# Altium project Helianthus REV 2.1 .PrjPcb
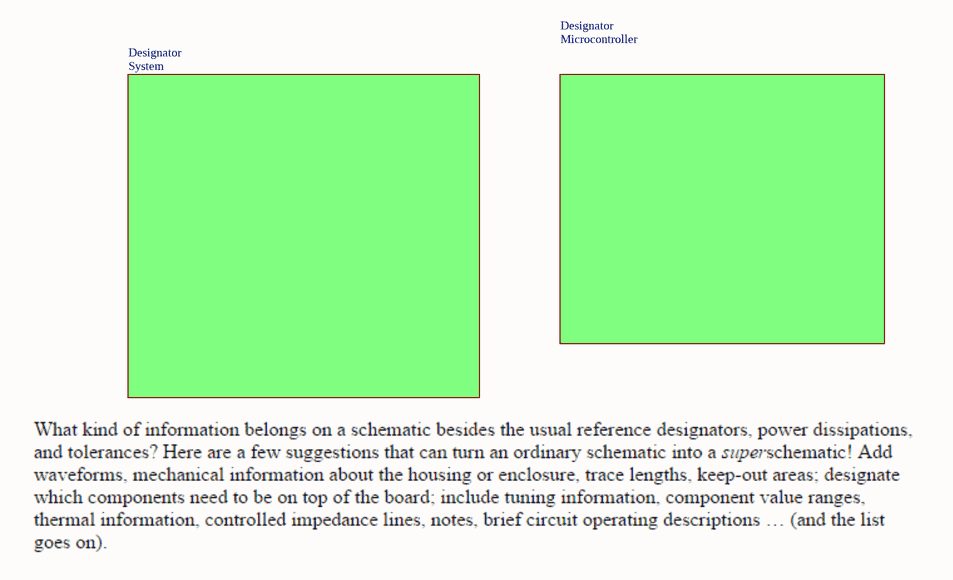
[diagram p0: Overview.SchDoc]
3 sheets, 68 parts. Net scope: global (net labels, ports and power ports of the same name join across sheets).
Board file: PCB_dense_experiment.PcbDoc
Sheets:
  Overview.SchDoc
    Designator = System.SchDoc
    Designator = Microcontroller.SchDoc

## Sheet Overview.SchDoc
size A

### Sub-sheets
Designator = System: no entries
Designator = Microcontroller: no entries

## Sheet System.SchDoc
size A
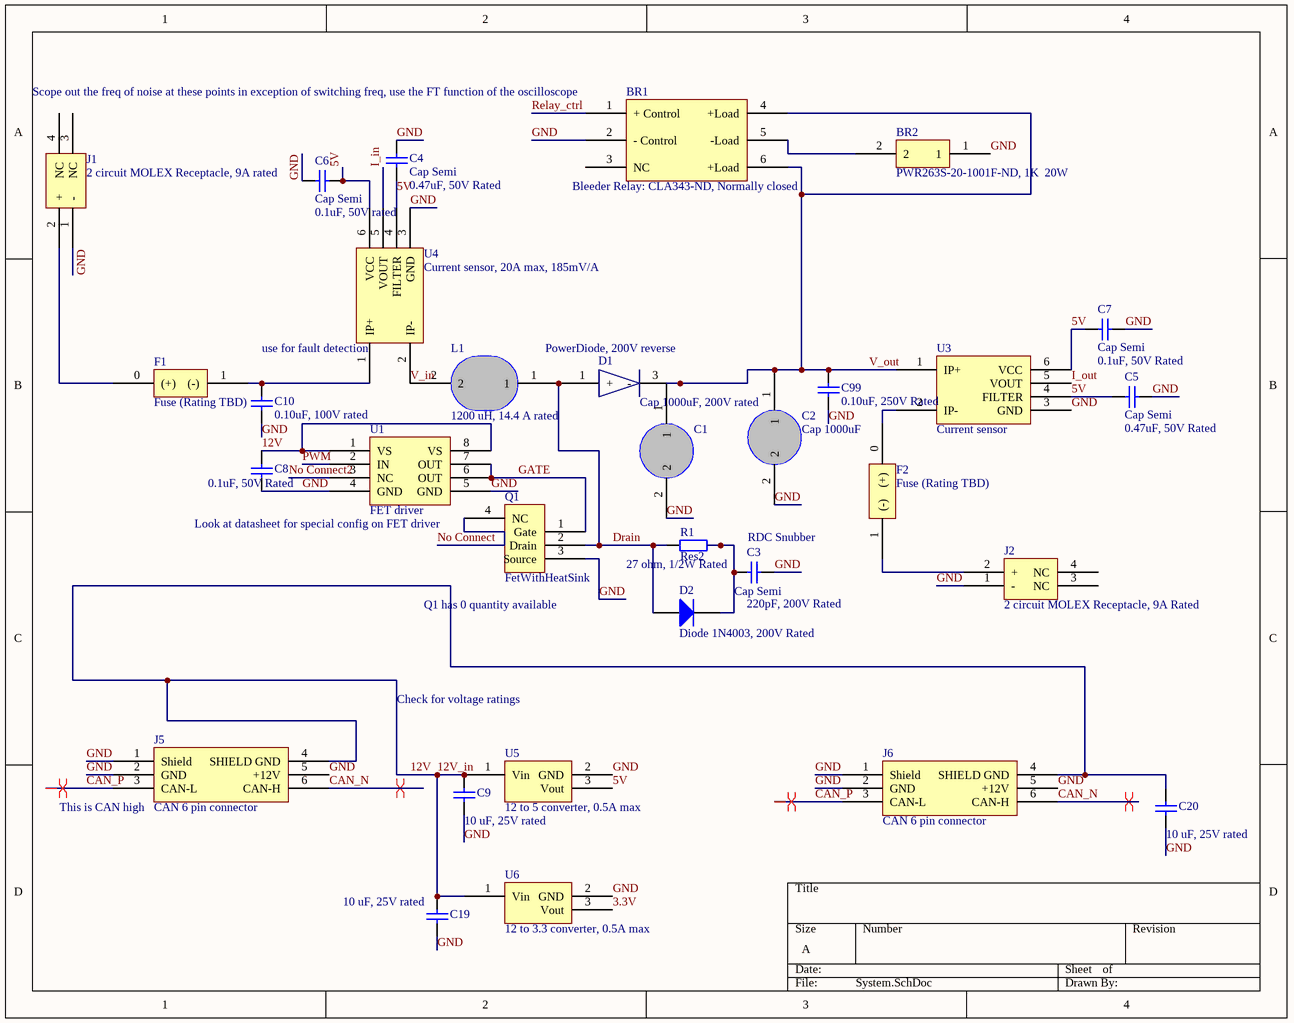
[diagram p1: System.SchDoc]

### Parts
BR1  Bleeder Relay: CLA343-ND, Normally closed  [Bleeder Relay: CLA343-ND]
BR2  PWR263S-20-1001F-ND, 1K  20W  [PWR263S-20-1001F-ND]
C1  Cap 1000uF, 200V rated  [LargeCap]
C2  Cap 1000uF  [LargeCap]
C3  Cap Semi  value 220pF, 200V Rated  [C1206]
C4  Cap Semi  value 0.47uF, 50V Rated  [C1206]
C5  Cap Semi  value 0.47uF, 50V Rated  [C1206]
C6  Cap Semi  value 0.1uF, 50V rated  [C1206]
C7  Cap Semi  value 0.1uF, 50V Rated  [C1206]
C8  value 0.1uF, 50V Rated  [C1206]  (hidden comment: Cap Semi)
C9  value 10 uF, 25V rated  [C1206]  (hidden comment: Cap Semi)
C10  value 0.10uF, 100V rated  [C1210]  (hidden comment: Cap Semi)
C19  value 10 uF, 25V rated  [C1206]  (hidden comment: Cap Semi)
C20  value 10 uF, 25V rated  [C1206]  (hidden comment: Cap Semi)
C99  value 0.10uF, 250V Rated  [C1210]  (hidden comment: Cap Semi)
D1  PowerDiode, 200V reverse  [PowerDiode]
D2  Diode 1N4003, 200V Rated  [Diode RDC]
F1  Fuse (Rating TBD)  [Fuseholder]
F2  Fuse (Rating TBD)  [Fuseholder]
J1  2 circuit MOLEX Receptacle, 9A rated  [2 circuit MOLEX Receptacle]
J2  2 circuit MOLEX Receptacle, 9A Rated  [2 circuit MOLEX Receptacle]
J5  CAN 6 pin connector  [CAN 6 pin connector]
J6  CAN 6 pin connector  [CAN 6 pin connector]
L1  1200 uH, 14.4 A rated  [Large Inductor]
Q1  FetWithHeatSink  [FetWithHeatSink]
R1  Res2  value 27 ohm, 1/2W Rated  [RES RDC]
U1  FET driver  [FET Driver]
U3  Current sensor  [Current sensor]
U4  Current sensor, 20A max, 185mV/A  [Current sensor]
U5  12 to 5 converter, 0.5A max  [12 to 5 converter]
U6  12 to 3.3 converter, 0.5A max  [12 to 5 converter]

### Nets
3.3V: U6.3(Vout)
5V: C4.1 C5.1 C6.1 C7.1 U3.4(FILTER) U3.6(VCC) U4.4(FILTER) U4.6(VCC) U5.3(Vout)
12V: C8.1 C9.2 C19.2 C20.2 J5.4(SHIELD_GND) J6.4(SHIELD_GND) U1.1(VS) U1.8(VS) U5.1(Vin) U6.1(Vin)  [also labelled 12V_in]
CAN_N: J5.6(CAN-H) J6.6(CAN-H)
CAN_P: J5.3(CAN-L) J6.3(CAN-L)
Drain: D1.1(+) D2.1(A) L1.1 Q1.2(Drain) R1.1
GATE: Q1.1(Gate) U1.6(OUT) U1.7(OUT)
GND: BR1.2(-_Control) BR2.1 C1.2 C2.2 C3.2 C4.2 C5.2 C6.2 C7.2 C8.2 C9.1 C10.2 C19.1 C20.1 C99.1 J1.1(-) J2.1(-) J5.1(Shield) J5.2(GND) J5.5(+12V) J6.1(Shield) J6.2(GND) J6.5(+12V) Q1.3(Source) U1.4(GND) U1.5(GND) U3.3(GND) U4.3(GND) U5.2(GND) U6.2(GND)
I_in: U4.5(VOUT)
I_out: U3.5(VOUT)
No Connect: Q1.4(NC)
No Connect2: U1.3(NC)
PWM: U1.2(IN)
Relay_ctrl: BR1.1(+_Control)
V_in: L1.2 U4.2(IP-)
V_out: BR1.4(+Load) BR1.6(+Load) C1.1 C2.1 C99.2 D1.3(-) U3.1(IP+)
NetBR1_5: BR1.5(-Load) BR2.2
NetC3_1: C3.1 D2.2(K) R1.2
NetC10_1: C10.1 F1.1((-)) U4.1(IP+)
NetF1_0: F1.0((+)) J1.2(+)
NetF2_0: F2.0((+)) U3.2(IP-)
NetF2_1: F2.1((-)) J2.2(+)

Not connected (* = marked no-connect by the designer): BR1 3(NC); J1 3(NC) 4(NC); J2 3(NC) 4(NC)

### Layout directives
differential pair: CAN_N, CAN_P

### Notes on the sheet
- (near BR1) Scope out the freq of noise at these points in exception of switching freq, use the FT function of the oscilloscope
- (near U4) use for fault detection
- (near Q1) Look at datasheet for special config on FET driver
- RDC Snubber
- (near Q1) Q1 has 0 quantity available
- Check for voltage ratings
- (near J5) This is CAN high

### Library data of the parts
BR1 = Bleeder Relay: CLA343-ND
BR2 = PWR263S-20-1001F-ND
C1 C2 = Cap 1200uF
C3-C10 C19 C20 C99 = Cap Semi: Capacitor (Semiconductor SIM Model); Published: 8-Jun-2000; LatestRevisionDate: 29-May-2009; LatestRevisionNote: IPC-7351 Footprint Added.; PackageReference: C1206; Publisher: Altium Limited; PackageDescription: Chip Capacitor
D1 = PowerDiode
D2 = Diode 1N4003: 1 Amp General Purpose Rectifier; Published: 8-Jun-2000; LatestRevisionDate: 17-Jul-2002; LatestRevisionNote: Re-released for DXP Platform.; DatasheetVersion: 1998; PackageVersion: Aug-1999; PackageReference: DO-41; Publisher: Altium Limited; PackageDescription: Diode, Axial; Body 5.2 x 2.7 mm (LxDia. max), Lead Dia. 0.86 mm (max); Code_JEDEC: DO-204-AL; ComponentLink1Description: Manufacturer Link; ComponentLink1URL: http://www.fairchildsemi.com/; ComponentLink2Description: Datasheet; ComponentLink2URL: http://www.fairchildsemi.com/ds/1N%2F1N4001.pdf
F1 F2 = Fuseholder
J1 J2 = 2 circuit MOLEX Receptacle
L1 = Large inductor: 120 uH
R1 = Res2: Resistor; Published: 8-Jun-2000; LatestRevisionDate: 17-Jul-2002; LatestRevisionNote: Re-released for DXP Platform.; PackageReference: AXIAL-0.4; Publisher: Altium Limited; PackageDescription: Axial Device, Thru-Hole; 2 Leads; 0.4 in Pin Spacing
U3 = Current sensor: This is the new current sensor 620-1262-1-ND
U4 = Current sensor: This is the new current sensor 620-1262-1-ND. Cap at filter pin determines the bandwidth of the device
U5 U6 = 12 to 5 converter

## Sheet Microcontroller.SchDoc
size A
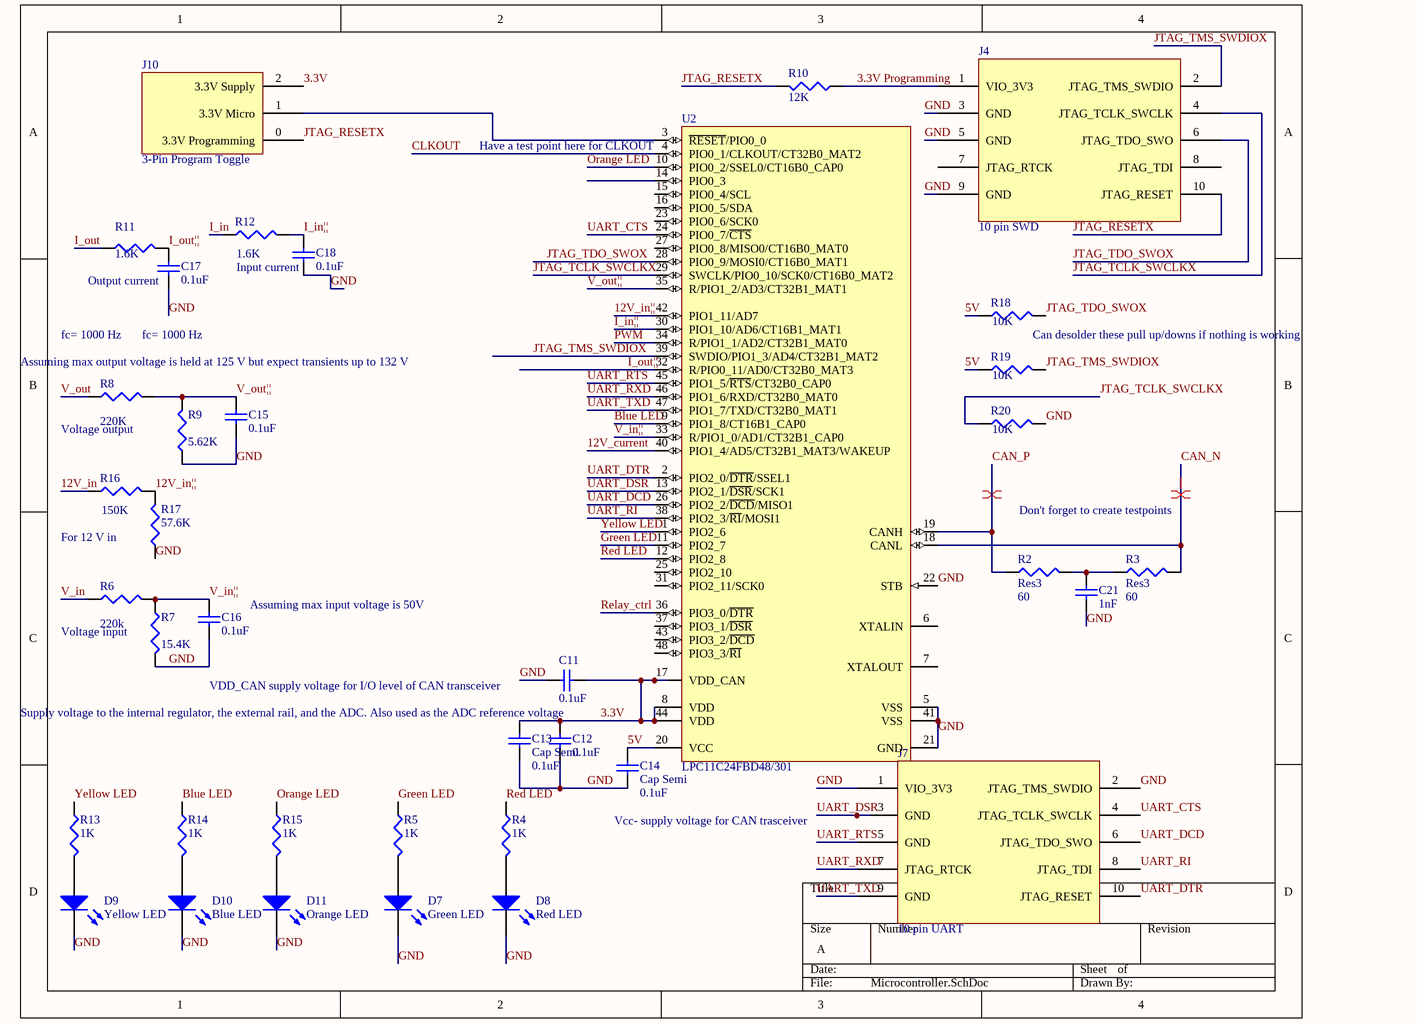
[diagram p2: Microcontroller.SchDoc]

### Parts
C11  value 0.1uF  [C1206]  (hidden comment: Cap Semi)
C12  value 0.1uF  [C1206]  (hidden comment: Cap Semi)
C13  Cap Semi  value 0.1uF  [C1206]
C14  Cap Semi  value 0.1uF  [C1206]
C15  value 0.1uF  [C1206]  (hidden comment: Cap Semi)
C16  value 0.1uF  [C1206]  (hidden comment: Cap Semi)
C17  value 0.1uF  [C1206]  (hidden comment: Cap Semi)
C18  value 0.1uF  [C1206]  (hidden comment: Cap Semi)
C21  value 1nF  [C1206]  (hidden comment: Cap Semi)
D7  Green LED  [C1206]
D8  Red LED  [C1206]
D9  Yellow LED  [C1206]
D10  Blue LED  [C1206]
D11  Orange LED  [C1206]
J4  10 pin SWD  [10 Pin JTAG/SWD]
J7  10 pin UART  [10 Pin JTAG/SWD]
J10  3-Pin Program Toggle  [3-Pin Program Toggle]
R2  Res3  value 60  [12Z-2010]
R3  Res3  value 60  [12Z-2010]
R4  value 1K  [C1206]  (hidden comment: Res3)
R5  value 1K  [C1206]  (hidden comment: Res3)
R6  value 220k  [C1206]  (hidden comment: Res3)
R7  value 15.4K  [C1206]  (hidden comment: Res3)
R8  value 220K  [C1206]  (hidden comment: Res3)
R9  value 5.62K  [C1206]  (hidden comment: Res3)
R10  value 12K  [C1206]  (hidden comment: Res3)
R11  value 1.6K  [C1206]  (hidden comment: Res3)
R12  value 1.6K  [C1206]  (hidden comment: Res3)
R13  value 1K  [C1206]  (hidden comment: Res3)
R14  value 1K  [C1206]  (hidden comment: Res3)
R15  value 1K  [C1206]  (hidden comment: Res3)
R16  value 150K  [C1206]  (hidden comment: Res3)
R17  value 57.6K  [C1206]  (hidden comment: Res3)
R18  value 10K  [C1206]  (hidden comment: Res3)
R19  value 10K  [C1206]  (hidden comment: Res3)
R20  value 10K  [C1206]  (hidden comment: Res3)
U2  LPC11C24FBD48/301  [SOT313-2_V]

### Nets
3.3V: C11.1 C12.2 C13.2 J10.2(3.3V_Supply) U2.8(VDD) U2.17(VDD_CAN) U2.44(VDD)
3.3V Programming: J4.1(VIO_3V3) R10.1
5V: C14.2 R18.1 R19.1 U2.20(VCC)
12V_current: U2.40(PIO1_4/AD5/CT32B1_MAT3/WAKEUP)
12V_in: R16.1  [project net 12V]
12V_in||: R16.2 R17.2 U2.42(PIO1_11/AD7)
Blue LED: R14.1 U2.9(PIO1_8/CT16B1_CAP0)
CAN_N: R3.2 U2.18(CANL)
CAN_P: R2.1 U2.19(CANH)
CLKOUT: U2.4(PIO0_1/CLKOUT/CT32B0_MAT2)
GND: C11.2 C12.1 C13.1 C14.1 C15.1 C16.2 C17.2 C18.2 C21.2 D7.2(K) D8.2(K) D9.2(K) D10.2(K) D11.2(K) J4.3(GND) J4.5(GND) J4.9(GND) J7.1(VIO_3V3) J7.2(JTAG_TMS_SWDIO) R7.2 R9.1 R17.1 R20.2 U2.5(VSS) U2.21(GND) U2.22(STB) U2.41(VSS)
Green LED: R5.1 U2.11(PIO2_7)
I_in: R12.1
I_in||: C18.1 R12.2 U2.30(PIO1_10/AD6/CT16B1_MAT1)
I_out: R11.1
I_out||: C17.1 R11.2 U2.32(R/PIO0_11/AD0/CT32B0_MAT3)
JTAG_RESETX: J4.10(JTAG_RESET) J10.0(3.3V_Programming) R10.2
JTAG_TCLK_SWCLKX: J4.4(JTAG_TCLK_SWCLK) R20.1 U2.29(SWCLK/PIO0_10/SCK0/CT16B0_MAT2)
JTAG_TDO_SWOX: J4.6(JTAG_TDO_SWO) R18.2 U2.28(PIO0_9/MOSI0/CT16B0_MAT1)
JTAG_TMS_SWDIOX: J4.2(JTAG_TMS_SWDIO) R19.2 U2.39(SWDIO/PIO1_3/AD4/CT32B1_MAT2)
Orange LED: R15.1 U2.10(PIO0_2/SSEL0/CT16B0_CAP0)
PWM: U2.34(R/PIO1_1/AD2/CT32B1_MAT0)
Red LED: R4.1 U2.12(PIO2_8)
Relay_ctrl: U2.36(PIO3_0/~{DTR})
UART_CTS: J7.4(JTAG_TCLK_SWCLK) U2.24(PIO0_7/~{CTS})
UART_DCD: J7.6(JTAG_TDO_SWO) U2.26(PIO2_2/~{DCD}/MISO1)
UART_DSR: J7.3(GND) U2.13(PIO2_1/~{DSR}/SCK1)
UART_DTR: J7.10(JTAG_RESET) U2.2(PIO2_0/~{DTR}/SSEL1)
UART_RI: J7.8(JTAG_TDI) U2.38(PIO2_3/~{RI}/MOSI1)
UART_RTS: J7.5(GND) U2.45(PIO1_5/~{RTS}/CT32B0_CAP0)
UART_RXD: J7.7(JTAG_RTCK) U2.46(PIO1_6/RXD/CT32B0_MAT0)
UART_TXD: J7.9(GND) U2.47(PIO1_7/TXD/CT32B0_MAT1)
V_in: R6.1
V_in||: C16.1 R6.2 R7.1 U2.33(R/PIO1_0/AD1/CT32B1_CAP0)
V_out: R8.1
V_out||: C15.2 R8.2 R9.2 U2.35(R/PIO1_2/AD3/CT32B1_MAT1)
Yellow LED: R13.1 U2.1(PIO2_6)
NetC21_1: C21.1 R2.2 R3.1
NetD7_1: D7.1(A) R5.2
NetD8_1: D8.1(A) R4.2
NetD9_1: D9.1(A) R13.2
NetD10_1: D10.1(A) R14.2
NetD11_1: D11.1(A) R15.2
NetJ10_1: J10.1(3.3V_Micro) U2.3(~{RESET}/PIO0_0)

Not connected (* = marked no-connect by the designer): J4 7(JTAG_RTCK) 8(JTAG_TDI); U2 6(XTALIN) 7(XTALOUT) 14(PIO0_3) 15(PIO0_4/SCL) 16(PIO0_5/SDA) 23(PIO0_6/SCK0) 25(PIO2_10) 27(PIO0_8/MISO0/CT16B0_MAT0) 31(PIO2_11/SCK0) 37(PIO3_1/~{DSR}) 43(PIO3_2/~{DCD}) 48(PIO3_3/~{RI})

### Layout directives
differential pair: CAN_N, CAN_P

### Notes on the sheet
- (near U2) Have a test point here for CLKOUT
- (near C17) Output current
- (near C18) Input current
- Assuming max output voltage is held at 125 V but expect transients up to 132 V
- fc= 1000 Hz
- (near R18) Can desolder these pull up/downs if nothing is working
- Voltage output
- For 12 V in
- Don't forget to create testpoints
- Voltage input
- (near C16) Assuming max input voltage is 50V
- (near C11) VDD_CAN supply voltage for I/O level of CAN transceiver
- (near U2) Supply voltage to the internal regulator, the external rail, and the ADC. Also used as the ADC reference voltage
- Vcc- supply voltage for CAN trasceiver

### Library data of the parts
C11-C18 C21 = Cap Semi: Capacitor (Semiconductor SIM Model); Published: 8-Jun-2000; LatestRevisionDate: 29-May-2009; LatestRevisionNote: IPC-7351 Footprint Added.; PackageReference: C1206; Publisher: Altium Limited; PackageDescription: Chip Capacitor
D7-D11 = LED0: Typical INFRARED GaAs LED; Published: 8-Jun-2000; LatestRevisionDate: 08-Jul-2005; LatestRevisionNote: Mech Layer 1 removed.; PackageReference: LED-0; Publisher: Altium Limited; PackageDescription: LED; 2 Leads
J4 J7 = 10 pin JTAG
R2-R20 = Res3: Resistor; Published: 8-Jun-2000; LatestRevisionDate: 29-May-2009; LatestRevisionNote: IPC-7351 Footprint Added.; PackageReference: J1-0603; Publisher: Altium Limited; PackageDescription: Chip Resistor
U2 = LPC11C24FBD48/301: 32-bit ARM Cortex-M0 MCU, 32 kB Flash, 8 kB SRAM, CAN, CAN drivers on-chip, CAN Transceiver, 48-Pin LQFP; fmax: 50 MHz; SRAM: 8 kB; Flash: 32 kB; GPIOs: 36; CAN: 1; SPI: 2; PLL: Y; Timers: 4; ADC channels: 8; VDD (min): 1.8 V; VDD (typ): 3.3 V; VDD (max): 3.6 V; Code_IEC: 136E05; DatasheetVersion: Rev. 3, Jun-2011; PackageVersion: Feb-2003; PackageReference: SOT313-2; PackageDescription: LQFP48: Plastic Low Profile Quad Flat Package; 48 Leads; Body 7 x 7 x 1.4 mm; UART: 1; I2C: 1; Code_JEDEC: MS-026; PartNumber: LPC11C24FBD48/301; ComponentLink1Description: Manufacturer URL; ComponentLink1URL: http://www.nxp.com/; ComponentLink2Description: Datasheet; ComponentLink2URL: http://www.nxp.com/documents/data_sheet/LPC11CX2_CX4.pdf

## Nets that join several sheets
3.3V: System (U6.3), Microcontroller (7 pins)
5V: System (9 pins), Microcontroller (C14.2 R18.1 R19.1 U2.20)
12V: System (10 pins), Microcontroller (R16.1)
CAN_N: System (J5.6 J6.6), Microcontroller (R3.2 U2.18)
CAN_P: System (J5.3 J6.3), Microcontroller (R2.1 U2.19)
GND: System (30 pins), Microcontroller (27 pins)
I_in: System (U4.5), Microcontroller (R12.1)
I_out: System (U3.5), Microcontroller (R11.1)
PWM: System (U1.2), Microcontroller (U2.34)
Relay_ctrl: System (BR1.1), Microcontroller (U2.36)
V_in: System (L1.2 U4.2), Microcontroller (R6.1)
V_out: System (7 pins), Microcontroller (R8.1)